# Altium schematic sheet Laser_driver_adapter_PCB.SchDoc: Goldpin
size 420 x 297 mm; CheckedBy: MK; Author: G.K.; CompanyName: CREOTECH; DrawnBy: G.K.; Organization: CTI SA; Address1: Creotech Instruments SA; Address2: Okulickiego 7/9, 05-500 Poland; Revision: -; SheetNumber: -; SheetTotal: -; ModifiedBy: -; CreateDate: XX/XX/XXXX; CheckedDate: -; Title2: Jumper; DivGrp: CTI; Designer: G.K.; ModifiedDate: -; ProjectName: FMC DAC 100M 14B 16CHA ADC 2M 14B 4CHA
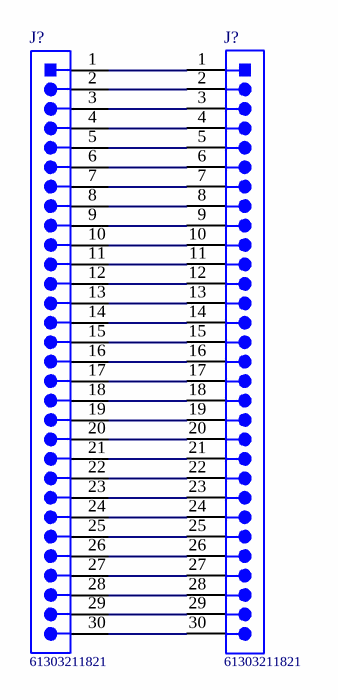
[diagram p0: Laser_driver_adapter_PCB.SchDoc]

## Parts
(Parts that share a designator on the sheet are numbered #1, #2 ... from top to bottom, then left to right.)
J?#1  61303211821  [61303211821_30]
J?#2  61303211821  [61303211821_30]

## Nets
NetJ?#1_1: J?#1.1 J?#2.1
NetJ?#1_2: J?#1.2 J?#2.2
NetJ?#1_3: J?#1.3 J?#2.3
NetJ?#1_4: J?#1.4 J?#2.4
NetJ?#1_5: J?#1.5 J?#2.5
NetJ?#1_6: J?#1.6 J?#2.6
NetJ?#1_7: J?#1.7 J?#2.7
NetJ?#1_8: J?#1.8 J?#2.8
NetJ?#1_9: J?#1.9 J?#2.9
NetJ?#1_10: J?#1.10 J?#2.10
NetJ?#1_11: J?#1.11 J?#2.11
NetJ?#1_12: J?#1.12 J?#2.12
NetJ?#1_13: J?#1.13 J?#2.13
NetJ?#1_14: J?#1.14 J?#2.14
NetJ?#1_15: J?#1.15 J?#2.15
NetJ?#1_16: J?#1.16 J?#2.16
NetJ?#1_17: J?#1.17 J?#2.17
NetJ?#1_18: J?#1.18 J?#2.18
NetJ?#1_19: J?#1.19 J?#2.19
NetJ?#1_20: J?#1.20 J?#2.20
NetJ?#1_21: J?#1.21 J?#2.21
NetJ?#1_22: J?#1.22 J?#2.22
NetJ?#1_23: J?#1.23 J?#2.23
NetJ?#1_24: J?#1.24 J?#2.24
NetJ?#1_25: J?#1.25 J?#2.25
NetJ?#1_26: J?#1.26 J?#2.26
NetJ?#1_27: J?#1.27 J?#2.27
NetJ?#1_28: J?#1.28 J?#2.28
NetJ?#1_29: J?#1.29 J?#2.29
NetJ?#1_30: J?#1.30 J?#2.30

## Notes on the sheet
- Project/Equipment
- Document
- Designer
- Drawn by
- Check.by
- Copyright Creotech Instruments SA 2014.
  This documentation describes Open Hardware and is licensed under the CERN OHL v.1.1. You may redistribute and modify this documentation under the terms of the CERN OHL v.1.1. (http://ohwr.org/CERNOHL). This documentation is distributed WITHOUT ANY EXPRESS OR IMPLIED WARRANTY, INCLUDING OF MERCHANTABILITY, SATISFACTORY QUALITY AND FITNESS FOR A PARTICULAR PURPOSE. Please see the CERN OHL v.1.1 for applicable conditions.
- File
- Last Mod.
- Print Date
- Sheet
- Size
- A3
- of
- Rev

## Library data of the parts
J?#1 J?#2 = CON_1x30_2.54_61303211821: WR-PHD socket Header, THT, pitch 2.54mm, Single Row, Angled, 32p; Manufacturer: Wurth Elektronik; Pin Number: 32; Gender: Pin Header; Rated Current: 3A; Working Voltage: 250VAC; Withstanding Voltage: 500VAC; Contact Resistance: 20mOhm; ComponentLink1Description: Manufacturer; ComponentLink1URL: http://www.we-online.de; ComponentLink2Description: Datasheet; ComponentLink2URL: https://www.we-online.com/catalog/datasheet/61303211021.pdf; Manufacturer Part Number: 61303211821; Pitch: 2.54mm; Operating Temperature: -40 to +105degC; Mounting Technology: THT; Packaging: Bag; Row Number: Single; Orientation: Angled